# EAGLE schematic magnet_v2 (EAGLE 9.6.2)
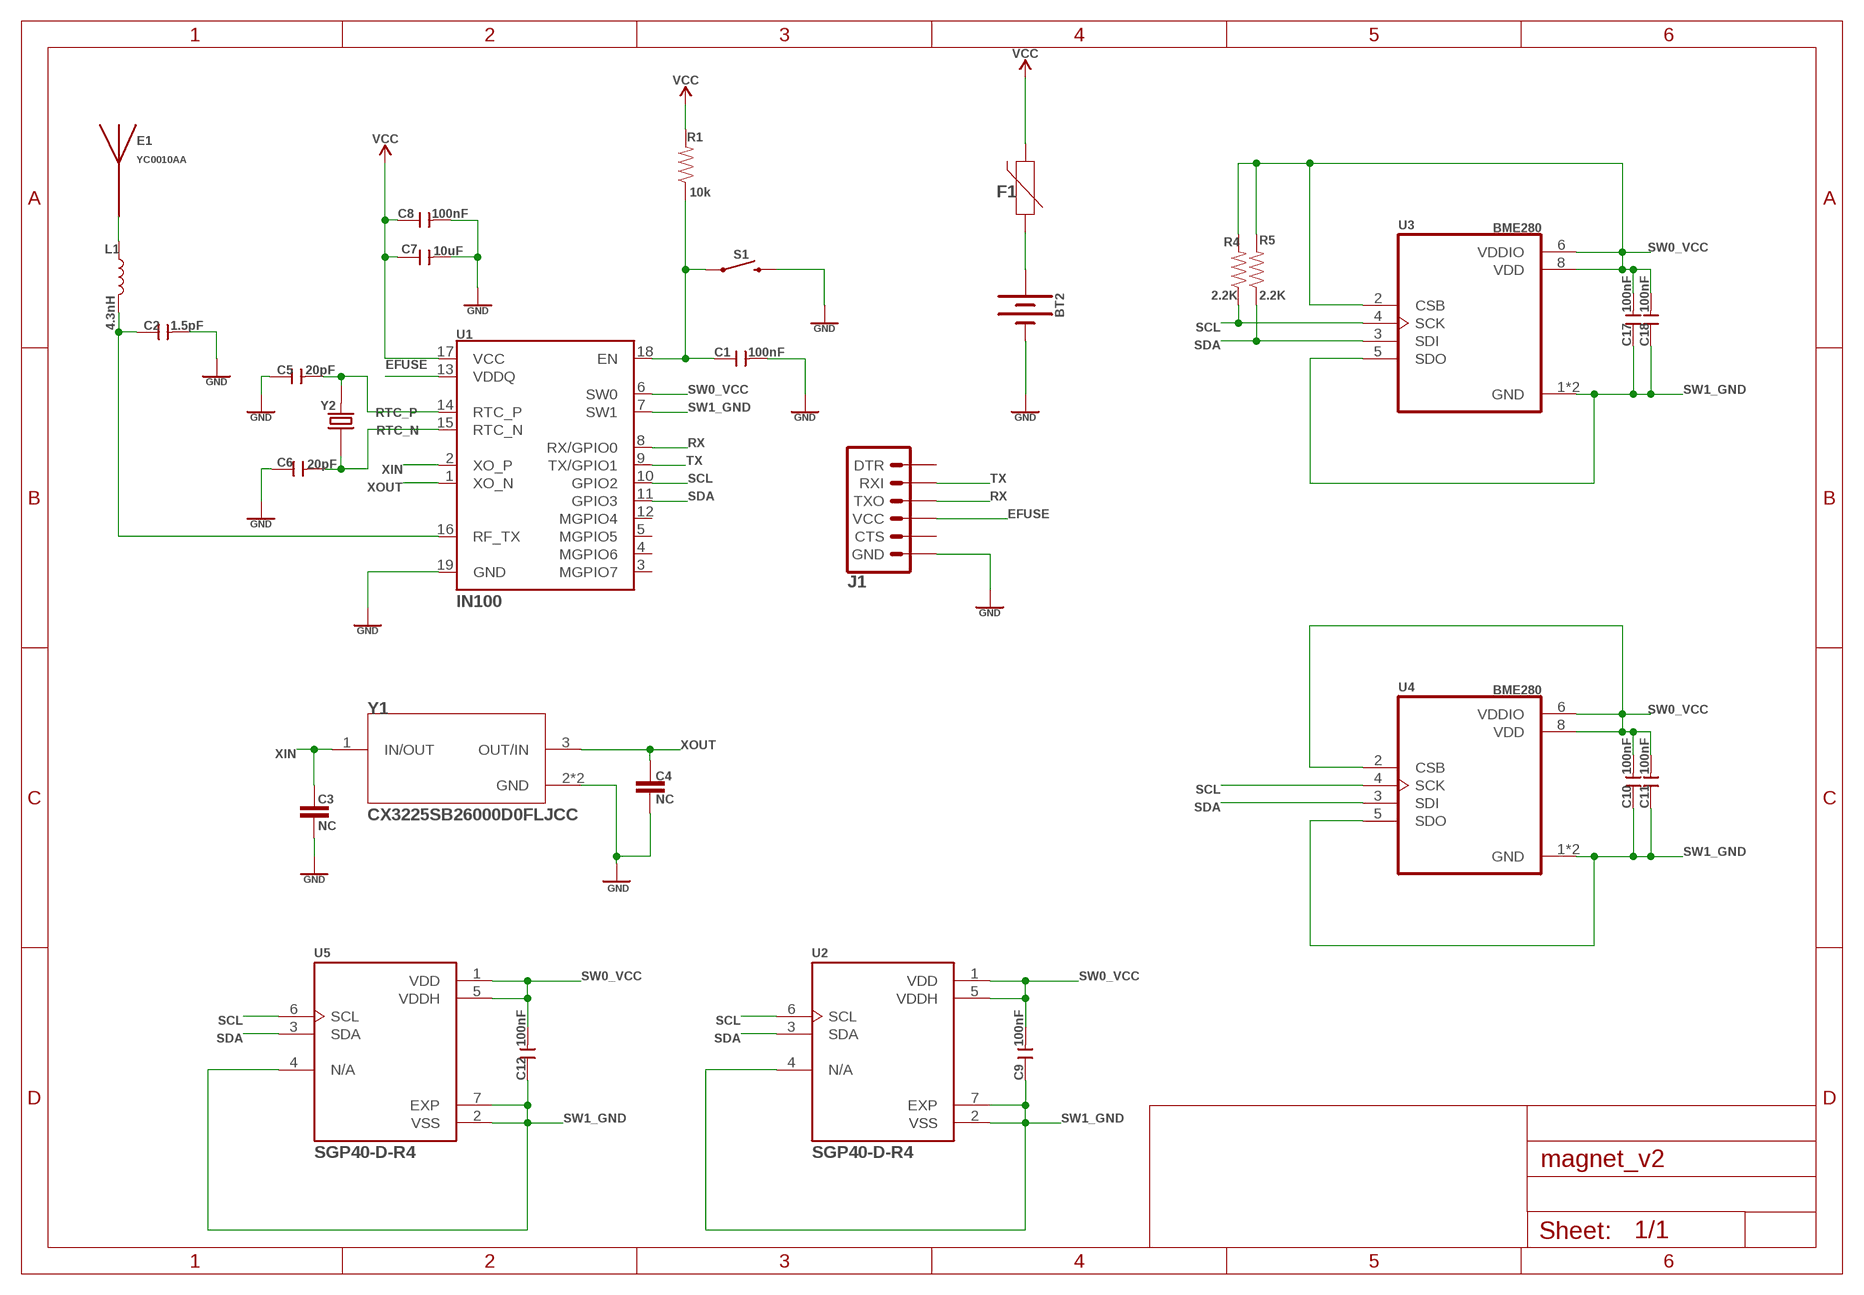
[diagram p0: schematic, sheet 1]

## Parts
BT2  BATTERY-12MM_SMD  [BATTCON_12MM]
C1  100nF  CERAMIC-100NF-50V-10%-X7R(0603)  [C0603]
C2  1.5pF  CERAMIC-10PF-50V-5%-NPO(0603)  [C0603]
C3  NC  12PF-0603-50V-5%  [0603]
C4  NC  12PF-0603-50V-5%  [0603]
C5  20pF  CERAMIC-22PF-50V-5%-NPO(0603)  [C0603]
C6  20pF  CERAMIC-22PF-50V-5%-NPO(0603)  [C0603]
C7  10uF  CERAMIC-10UF-10V-10%-X5R(0603)  [C0603]
C8  100nF  CERAMIC-100NF-50V-10%-X7R(0603)  [C0603]
C9  100nF  CERAMIC-100NF-50V-10%-X7R(0603)  [C0603]
C10  100nF  CERAMIC-100NF-50V-10%-X7R(0603)  [C0603]
C11  100nF  CERAMIC-100NF-50V-10%-X7R(0603)  [C0603]
C12  100nF  CERAMIC-100NF-50V-10%-X7R(0603)  [C0603]
C17  100nF  CERAMIC-100NF-50V-10%-X7R(0603)  [C0603]
C18  100nF  CERAMIC-100NF-50V-10%-X7R(0603)  [C0603]
E1  YC0010AA  [XCVR_YC0010AA]
F1  RESC3115X65N  [RESC3115X65N]
J1  6_PIN_SERIAL_TARGETSMD  [1X06-SMD_RA_MALE]
L1  4.3nH  INDUCTOR-0603-33NH  [0603]
R1  10k  10KOHM-0603-1/10W-1%  [0603]
R4  2.2K  2.2KOHM-0603-1/10W-1%  [0603]
R5  2.2K  2.2KOHM-0603-1/10W-1%  [0603]
S1  MOMENTARY-SWITCH-SPST-SMD-4.6X2.8MM  [TACTILE_SWITCH_SMD_4.6X2.8MM]
U1  IN100  [IN100]
U2  SGP40-D-R4  [XCDR_SGP40-D-R4]
U3  BME280  [PSON65P250X250X100-8N]
U4  BME280  [PSON65P250X250X100-8N]
U5  SGP40-D-R4  [XCDR_SGP40-D-R4]
Y1  CX3225SB26000D0FLJCC  ECS-480-8-33B-CWY-TR3  [XTAL_ECS-480-8-33B-CWY-TR3]
Y2  ECS-.327-12.5-16-TR  [XTAL_ECS-.327-12.5-16-TR]

## Nets
EFUSE: J1.4(VCC) U1.13(VDDQ)
GND: BT2.GND(-) C1.2 C2.2 C3.2 C4.2 C5.1 C6.1 C7.2 C8.2 J1.6(GND) S1.3 S1.4 U1.19(GND) Y1.2(GND) Y1.4(GND)
N$1: C2.1 L1.2 U1.16(RF_TX)
N$2: E1.1 L1.1
N$3: C1.1 R1.1 S1.1 S1.2 U1.18(EN)
N$4: BT2.PWR@1(+) F1.1
RTC_N: C6.2 U1.15(RTC_N) Y2.1
RTC_P: C5.2 U1.14(RTC_P) Y2.2
RX: J1.3(TXO) U1.8(RX/GPIO0)
SCL: R4.1 U1.10(GPIO2) U2.6(SCL) U3.4(SCK) U4.4(SCK) U5.6(SCL)
SDA: R5.1 U1.11(GPIO3) U2.3(SDA) U3.3(SDI) U4.3(SDI) U5.3(SDA)
SW0_VCC: C9.2 C10.2 C11.2 C12.2 C17.2 C18.2 R4.2 R5.2 U1.6(SW0) U2.1(VDD) U2.5(VDDH) U3.2(CSB) U3.6(VDDIO) U3.8(VDD) U4.2(CSB) U4.6(VDDIO) U4.8(VDD) U5.1(VDD) U5.5(VDDH)
SW1_GND: C9.1 C10.1 C11.1 C12.1 C17.1 C18.1 U1.7(SW1) U2.2(VSS) U2.4(N/A) U2.7(EXP) U3.1(GND) U3.5(SDO) U3.7(GND) U4.1(GND) U4.5(SDO) U4.7(GND) U5.2(VSS) U5.4(N/A) U5.7(EXP)
TX: J1.2(RXI) U1.9(TX/GPIO1)
VCC: C7.1 C8.1 F1.2 R1.2 U1.17(VCC)
XIN: C3.1 U1.2(XO_P) Y1.1(IN/OUT)
XOUT: C4.1 U1.1(XO_N) Y1.3(OUT/IN)
Unconnected: J1.1(DTR) J1.5(CTS) U1.3(MGPIO7) U1.4(MGPIO6) U1.5(MGPIO5) U1.12(MGPIO4)

## Library data of the parts
BT2 = SparkFun-Batteries:BATTERY: Battery - Single Cell A variety of battery chemistries, sizes, and footprints. Device List: 20MM_PTH - Coin Cell Battery Holder - 20mm (PTH) <https://www.sparkfun.com/products/783> 6.8MM_PTH - Coin Cell Battery Holder - 6.8MM(SMD) <https://www.digikey.com/product-detail/en/seiko-instruments/MS621FE-FL11E/728-1057-ND/1889208?WT.srch=1&gclid=CNOQ5a6LzdQCFZS2wAodXCkE0g> 12MM_SMD - Coin Cell Battery Holder - 12mm (SMD) <https://www.sparkfun.com/products/10592> 12MM_PTH - Coin Cell Battery Holder - 12mm (PTH) <https://www.sparkfun.com/products/7948> 20MM_SMD - 20mm Coin Cell Battery Holder (SMD) (2 legs) Used on the Big Time Watch Kit <https://www.sparkfun.com/products/11734> 20MM_SMD_4LEGS - Coin Cell Battery Holder - 20mm (SMD) <https://www.sparkfun.com/products/11892> 20MM_SMD_4LEGS_OVERPASTE - Coin Cell Battery Holder - 20mm (SMD) <https://www.sparkfun.com/products/11892> (Over-paste on the legs) 24.5MM_PTH - Coin Cell Battery Holder - 24.5mm (PTH) <https://www.sparkfun.com/products/8863> 9V - 9V Battery Holder - PC Mount Used on the SparkFun SparkPunk Sound Kit <https://www.sparkfun.com/products/11177> and SparkFun SparkPunk Sequencer Kit <https://www.sparkfun.com/products/12707> 18650 - Battery Holder - 18650 (PTH) <https://www.sparkfun.com/products/13113> AA - Battery Holder - 1xAA (PTH) <https://www.sparkfun.com/products/7949> AAA - Battery Holder - 1xAAA (PTH) <https://www.sparkfun.com/products/12718> AA_KIT - Battery Holder - 1xAA (PTH) <https://www.sparkfun.com/products/7949> Special kit package - pads only have exposed copper on one side of the board. AAA_KIT - Battery Holder - 1xAAA (PTH) <https://www.sparkfun.com/products/12718> Special kit package - pads only have exposed copper on one side of the board.; PROD_ID: BATT-08044; SF_SKU: PRT-10592
C1 C8-C12 C17 C18 = OPL_Capacitor:CERAMIC-100NF-50V-10%-X7R(0603): 302010138; MPN: CC0603KRX7R9BB104; VALUE: 100nf
C2 = OPL_Capacitor:CERAMIC-10PF-50V-5%-NPO(0603): 302010097; MPN: CC0603JRNPO9BN100; VALUE: 10pf
C3 C4 = SparkFun-Capacitors:12PF: 12pF ceramic capacitors A capacitor is a passive two-terminal electrical component used to store electrical energy temporarily in an electric field.; PROD_ID: CAP-09137; VALUE: 12pF
C5 C6 = OPL_Capacitor:CERAMIC-22PF-50V-5%-NPO(0603): 302010143; MPN: CC0603JRNPO9BN220; VALUE: 22pf
C7 = OPL_Capacitor:CERAMIC-10UF-10V-10%-X5R(0603): 302010103; MPN: CC0603KRX5R6BB106; VALUE: 10uf
E1 = YC0010AA:YC0010AA: 2400 ~ 2500MHz, Wi-Fi（BT）, 5.2*2.0*1.2mm,ceramic SMD Antenna Check availability <https://pricing.snapeda.com/parts/YC0010AA/Quectel/view-part?ref=eda>; AVAILABILITY: In Stock; DESCRIPTION: 2400 ~ 2500MHz, Wi-Fi（BT）, 5.2*2.0*1.2mm,ceramic SMD Antenna; MF: Quectel; MP: YC0010AA; PACKAGE: None; PRICE: None; PURCHASE-URL: https://pricing.snapeda.com/search/part/YC0010AA/?ref=eda
F1 = RESC3115X65N:RESC3115X65N
J1 = SparkFun-Connectors:6_PIN_SERIAL_TARGET: 6-pin header connection for use with the "FTDI BASIC" pinout - TARGET SIDE. Also known as "Arduino Serial Program Header". It is used to mate with our FTDI Basic serial programmers using the Arduino IDE. Note, this device has "TARGET" in the name. It is intended to be used on a design that contains a target micro-controller that you wish to program. The "sister" device, named "CABLE" is inteneded to be used on a design that usually lives on the end of your USB cable and prvides the converter chip (FTDI232 or FTDI231x) to commnicate serial RX/TX. You can populate with some of these: Break Away Headers - Straight <https://www.sparkfun.com/products/116> (PRT-00116) For reference (or to suit your programming needs) check out these designs: SparkFun FTDI Basic Breakout - 5V <https://www.sparkfun.com/products/9716> (DEV-09716) SparkFun FTDI Basic Breakout - 3.3V <https://www.sparkfun.com/products/9873> (DEV-09873) SparkFun FTDI SmartBasic <https://www.sparkfun.com/products/12935> (DEV-12935) SparkFun Beefy 3 - FTDI Basic Breakout <https://www.sparkfun.com/products/13746> (DEV-13746); PROD_ID: CONN-08971
L1 = SparkFun-Coils:INDUCTOR: Inductors Resist changes in electrical current. Basically a coil of wire. SparkFun Products: SparkFun Load Cell Amplifier - HX711 <https://www.sparkfun.com/products/13879> IOIO-OTG - V2.2 <https://www.sparkfun.com/products/13613>; PROD_ID: NDUC-07874; VALUE: 33nH/±5%/500mA
R1 = SparkFun-Resistors:10KOHM: 10kΩ resistor A resistor is a passive two-terminal electrical component that implements electrical resistance as a circuit element. Resistors act to reduce current flow, and, at the same time, act to lower voltage levels within circuits. - Wikipedia; PROD_ID: RES-00824
R4 R5 = SparkFun-Resistors:2.2KOHM: 2.2kΩ resistor A resistor is a passive two-terminal electrical component that implements electrical resistance as a circuit element. Resistors act to reduce current flow, and, at the same time, act to lower voltage levels within circuits. - Wikipedia; PROD_ID: RES-08272; VALUE: 2.2k
S1 = SparkFun-Switches:MOMENTARY-SWITCH-SPST: Momentary Switch (Pushbutton) - SPST Normally-open (NO) SPST momentary switches (buttons, pushbuttons). Variants PTH-12MM - 12mm square, through-hole Momentary Pushbutton Switch - 12mm Square <https://www.sparkfun.com/products/9190> (COM-09190) PTH-6.0MM, PTH-6.0MM-KIT - 6.0mm square, through-hole Mini Pushbutton Switch <https://www.sparkfun.com/products/97> (COM-00097) KIT package intended for soldering kit's - only one side of pads' copper is exposed. PTH-RIGHT-ANGLE-KIT - Right-angle, through-hole Right Angle Tactile Button <https://www.sparkfun.com/products/10791> - Used on SparkFun BigTime Watch Kit <https://www.sparkfun.com/products/11734> SMD-12MM - 12mm square, surface-mount Tactile Button - SMD (12mm) <https://www.sparkfun.com/products/12993> (COM-12993) Used on SparkFun PicoBoard <https://www.sparkfun.com/products/11888> SMD-4.5MM - 4.5mm Square Trackball Switch Used on SparkFun Blackberry Trackballer Breakout <https://www.sparkfun.com/products/13169> SMD-4.6MMX2.8MM - 4.60mm x 2.80mm, surface mount Used on SparkFun SAMD21 Mini Breakout <https://www.sparkfun.com/products/13664> SMD-5.2MM, SMD-5.2-REDUNDANT - 5.2mm square, surface-mount Mini Pushbutton Switch - SMD <https://www.sparkfun.com/products/8720> (COM-08720) Used on Arduino Pro Mini <https://www.sparkfun.com/products/11114> REDUNDANT package connects both switch circuits together SMD-6.0X3.5MM - 6.0 x 3.5mm, surface mount Momentary Reset Switch SMD <https://www.sparkfun.com/products/8229> (COM-08229) SMD-6.2MM-TALL - 6.2mm square, surface mount Tactile Button - SMD (6mm) <https://www.sparkfun.com/products/12992> Used on SparkFun Digital Sandbox <https://www.sparkfun.com/products/12651> SMD-RIGHT-ANGLE - Right-angle, surface mount Used on SparkFun Block for Intel® Edison - Arduino <https://www.sparkfun.com/products/13036>; PROD_ID: SWCH-13065
U1 = IN100:IN100; PROD_ID: IC-17260
U2 U5 = SGP40-D-R4:SGP40-D-R4: Check availability <https://pricing.snapeda.com/parts/SGP40-D-R4/Sensirion%20AG/view-part?ref=eda>; AVAILABILITY: In Stock; DESCRIPTION: AIR QUALITY GAS SENSOR LOW POWER; MF: Sensirion AG; MP: SGP40-D-R4; PACKAGE: None; PRICE: None; PURCHASE-URL: https://pricing.snapeda.com/search/part/SGP40-D-R4/?ref=eda
U3 U4 = BME280:BME280: DIGITAL HUMIDITY, PRESSURE AND TEMPERATURE SENSOR * Digital interface I²C (up to 3.4 MHz) and SPI (3 and 4 wire, up to 10 MHz)* Supply voltage VDD main supply voltage range: 1.71 V to 3.6 V*VDDIO interface voltage range: 1.2 V to 3.6 V Operating range -40…+85 °C, 0…100 % rel. humidity, 300…1100 hPa The library has been designed by Richard Magdycz <https://www.facebook.com/groups/eaglecadsoftUK> Check availability <https://pricing.snapeda.com/parts/BME280/Bosch/view-part?ref=eda>; AVAILABILITY: In Stock; DESCRIPTION: Board Mount Humidity Sensors MEMS humidity, pressure and temperature sensor; MF: Bosch; MP: BME280; PACKAGE: LGA-8 Bosch; PRICE: None; PURCHASE-URL: https://pricing.snapeda.com/search/part/BME280/?ref=eda
Y1 = CX3225SB26000D0FLJCC:ECS-480-8-33B-CWY-TR3: Check availability <https://pricing.snapeda.com/parts/ECS-480-8-33B-CWY-TR3/ECS%20Inc./view-part?ref=eda>; AVAILABILITY: In Stock; DESCRIPTION: Crystal - 48MHz ±10ppm - 10 pF - ±15 ppm - -30 to +85°C 3225 Low aging; MF: Kyocera; MP: CX3225SB26000D0FLJCC; PACKAGE: None; PRICE: None; PURCHASE-URL: https://pricing.snapeda.com/search/part/ECS-480-8-33B-CWY-TR3/?ref=eda
Y2 = ECS-.327-12.5-16-TR:ECS-.327-12.5-16-TR: SMD Tuning Fork Crystal Check availability <https://pricing.snapeda.com/parts/ECS-.327-12.5-16-TR/ECS%20Inc./view-part?ref=eda>; AVAILABILITY: In Stock; DESCRIPTION: 32.768 kHz ±20ppm Crystal 12.5pF 90 kOhms 2-SMD, No Lead; MF: ECS Inc.; MP: ECS-.327-12.5-16-TR; PACKAGE: SMD-2 ECS International; PRICE: None; PURCHASE-URL: https://pricing.snapeda.com/search/part/ECS-.327-12.5-16-TR/?ref=eda